# EAGLE design Temp (EAGLE 9.6.2)
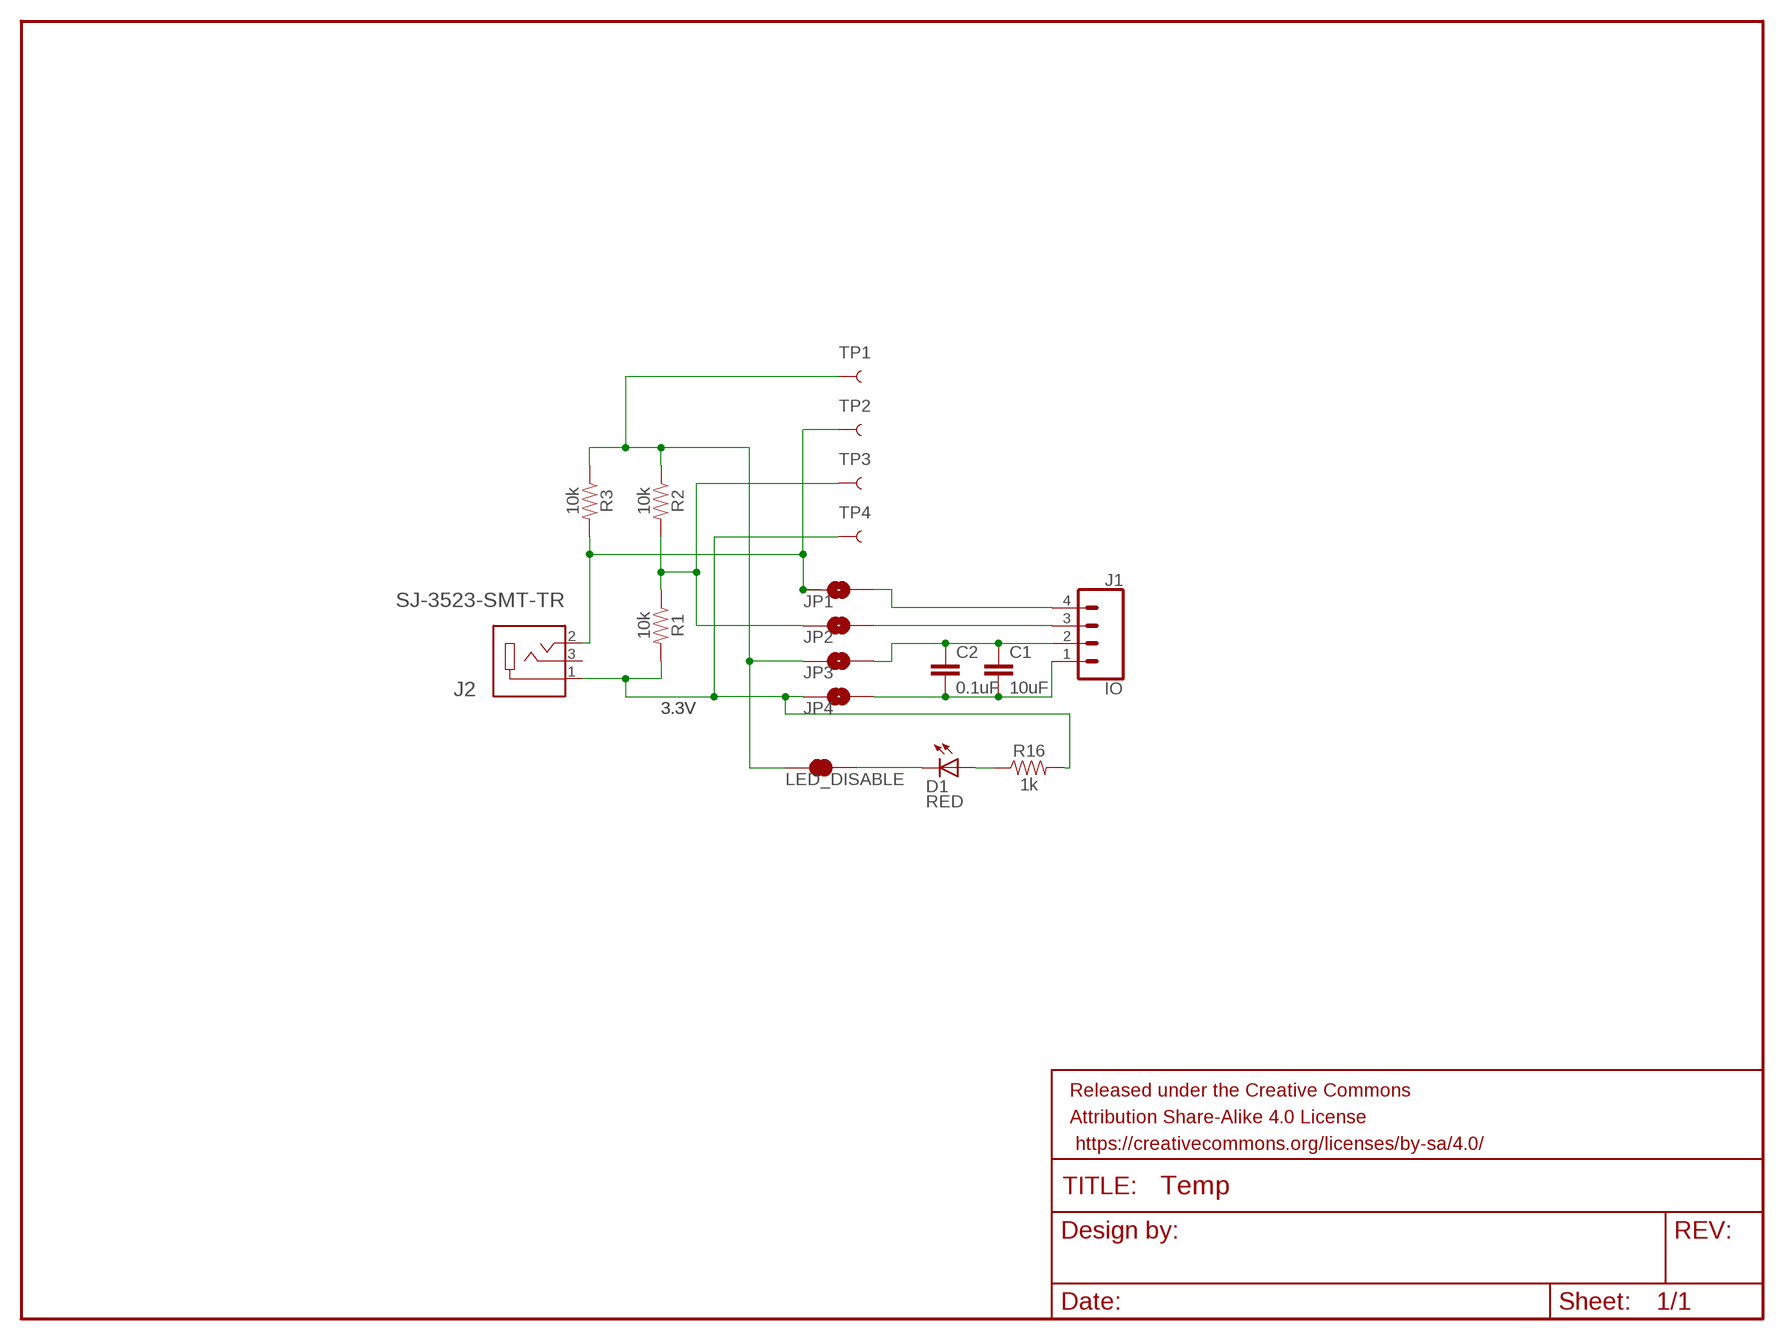
[diagram p0: schematic, sheet 1]

## Parts
C1  10uF  10UF-0603-6.3V-20%  [0603]
C2  0.1uF  0.1UF-0603-25V-(+80/-20%)  [0603]
D1  RED  LED-RED0603  [LED-0603]
FRAME1  FRAME-LETTERNO_PACKAGE  [DUMMY]
J1  IO  CONN_04  [1X04]
J2  SJ-3523-SMT-TR  [CUI_SJ-3523-SMT-TR]
JP1  JUMPER-SMT_2_NO_NO-SILK  [SMT-JUMPER_2_NO_NO-SILK]
JP2  JUMPER-SMT_2_NO_NO-SILK  [SMT-JUMPER_2_NO_NO-SILK]
JP3  JUMPER-SMT_2_NO_NO-SILK  [SMT-JUMPER_2_NO_NO-SILK]
JP4  JUMPER-SMT_2_NO_NO-SILK  [SMT-JUMPER_2_NO_NO-SILK]
LED_DISABLE  JUMPER-SMT_2_NC_TRACE_SILK  [SMT-JUMPER_2_NC_TRACE_SILK]
R1  10k  10KOHM-0603-1/10W-1%  [0603]
R2  10k  10KOHM-0603-1/10W-1%  [0603]
R3  10k  10KOHM-0603-1/10W-1%  [0603]
R16  1k  1KOHM-0603-1/10W-1%  [0603]
TP1  TEST-POINT3X5  [PAD.03X.05]
TP2  TEST-POINT3X5  [PAD.03X.05]
TP3  TEST-POINT3X5  [PAD.03X.05]
TP4  TEST-POINT3X5  [PAD.03X.05]

## Nets
3.3V: J2.1 JP4.1 R1.2 R16.2 TP4.P$1
N$1: JP3.1 LED_DISABLE.1 R2.1 R3.1 TP1.P$1
N$2: C1.2 C2.2 J1.1 JP4.2
N$3: JP2.1 R1.1 R2.2 TP3.P$1
N$4: C1.1 C2.1 J1.2 JP3.2
N$5: J1.3 JP2.2
N$6: J2.2 JP1.1 R3.2 TP2.P$1
N$7: J1.4 JP1.2
N$26: D1.A R16.1
N$28: D1.C LED_DISABLE.2
Unconnected: J2.3

## Library data of the parts
C1 = SparkFun-Capacitors:10UF: 10.0µF ceramic capacitors A capacitor is a passive two-terminal electrical component used to store electrical energy temporarily in an electric field.; PROD_ID: CAP-11015
C2 = SparkFun-Capacitors:0.1UF: 0.1µF ceramic capacitors A capacitor is a passive two-terminal electrical component used to store electrical energy temporarily in an electric field.; PROD_ID: CAP-00810
D1 = SparkFun-LED:LED-RED: Assorted Red LEDs LilyPad 1206- DIO-09912 1206- DIO-00809 0603- DIO-00819; PROD_ID: DIO-00819
FRAME1 = SparkFun-Aesthetics:FRAME-LETTER: Schematic Frame - Letter Standard 8.5x11 US Letter frame; DESIGNER: Nobody; VERSION: v01
J1 = SparkFun-Connectors:CONN_04: Multi connection point. Often used as Generic Header-pin footprint for 0.1 inch spaced/style header connections On any of the 0.1 inch spaced packages, you can populate with these: Break Away Headers - Straight <https://www.sparkfun.com/products/116> (PRT-00116) Break Away Male Headers - Right Angle <https://www.sparkfun.com/products/553> (PRT-00553) Female Headers <https://www.sparkfun.com/products/115> (PRT-00115) Break Away Headers - Machine Pin <https://www.sparkfun.com/products/117> (PRT-00117) Break Away Female Headers - Swiss Machine Pin <https://www.sparkfun.com/products/743> (PRT-00743) For SCREWTERMINALS and SPRING TERMINALS visit here: Screw Terimnals on SparkFun.com <https://www.sparkfun.com/search/results?term=Screw+Terminals> (5mm/3.5mm/2.54mm spacing) This device is also useful as a general connection point to wire up your design to another part of your project. Our various solder wires solder well into these plated through hole pads. Hook-Up Wire - Assortment (Stranded, 22 AWG) <https://www.sparkfun.com/products/11375> (PRT-11375) Hook-Up Wire - Assortment (Solid Core, 22 AWG) <https://www.sparkfun.com/products/11367> (PRT-11367) View the entire wire category on our website here <https://www.sparkfun.com/categories/141> Special notes: Molex polarized connector foot print use with SKU : PRT-08231 with associated crimp pins and housings. 1MM SMD Version SKU: PRT-10208; PROD_ID: CONN-09696
J2 = SJ-3523-SMT-TR:SJ-3523-SMT-TR: Audio Jack Connector 3.5 mm Low Profile Surface Mount Stereo Jack, 3 Pin Right-Angle Check availability <https://pricing.snapeda.com/parts/SJ-3523-SMT-TR/CUI%20Devices/view-part?ref=eda>; AVAILABILITY: In Stock; CUI_PURCHASE_URL: https://www.cuidevices.com/product/interconnect/connectors/audio-connectors/jacks/sj-352x-smt-series?utm_source=snapeda.com&utm_medium=referral&utm_campaign=snapedaBOM; DESCRIPTION: 3.5 mm, Stereo, Right Angle, Surface Mount (SMT), 3 Conductors, 0~1 Internal Switches, Audio Jack Connector; MF: CUI Devices; MP: SJ-3523-SMT-TR; PACKAGE: None; PRICE: None; PURCHASE-URL: https://pricing.snapeda.com/search/part/SJ-3523-SMT-TR/?ref=eda
JP1-JP4 = SparkFun-Jumpers:JUMPER-SMT_2_NO: Normally open jumper This jumper has two pads in close proximity to each other. Apply solder to close the connection. Round pads are easier to solder for beginners, but are a lot larger. SparkFun Product that uses the round pads: SparkFun EL Sequencer <https://www.sparkfun.com/products/12781>
LED_DISABLE = SparkFun-Jumpers:JUMPER-SMT_2_NC_TRACE: Normally closed trace jumper This jumper has a trace between two pads so it's normally closed (NC). Use a razor knife to open the connection. For best results follow the IPC guidelines for cutting traces: Cutout at least 0.063 mm (0.005 in). Remove all loose material to clean up the cut area. Seal the cut with an approved epoxy. Reapply solder to reclose the connection.
R1-R3 = SparkFun-Resistors:10KOHM: 10kΩ resistor A resistor is a passive two-terminal electrical component that implements electrical resistance as a circuit element. Resistors act to reduce current flow, and, at the same time, act to lower voltage levels within circuits. - Wikipedia; PROD_ID: RES-00824
R16 = SparkFun-Resistors:1KOHM: 1kΩ resistor A resistor is a passive two-terminal electrical component that implements electrical resistance as a circuit element. Resistors act to reduce current flow, and, at the same time, act to lower voltage levels within circuits. - Wikipedia; PROD_ID: RES-07856
TP1-TP4 = SparkFun-Connectors:TEST-POINT: SparkFun Test Points Bare copper test points for troubleshooting or In-Circuit-Testing. These are used by our Production team for verifying production board runs using pogo-pins on test beds. SparkFun Products: SparkFun LSM9DS1 Breakout <https://www.sparkfun.com/products/13284> SparkFun PSOC <https://www.sparkfun.com/products/13714> SparkFun Load Cell Amplifier <https://www.sparkfun.com/products/13879>

## Board
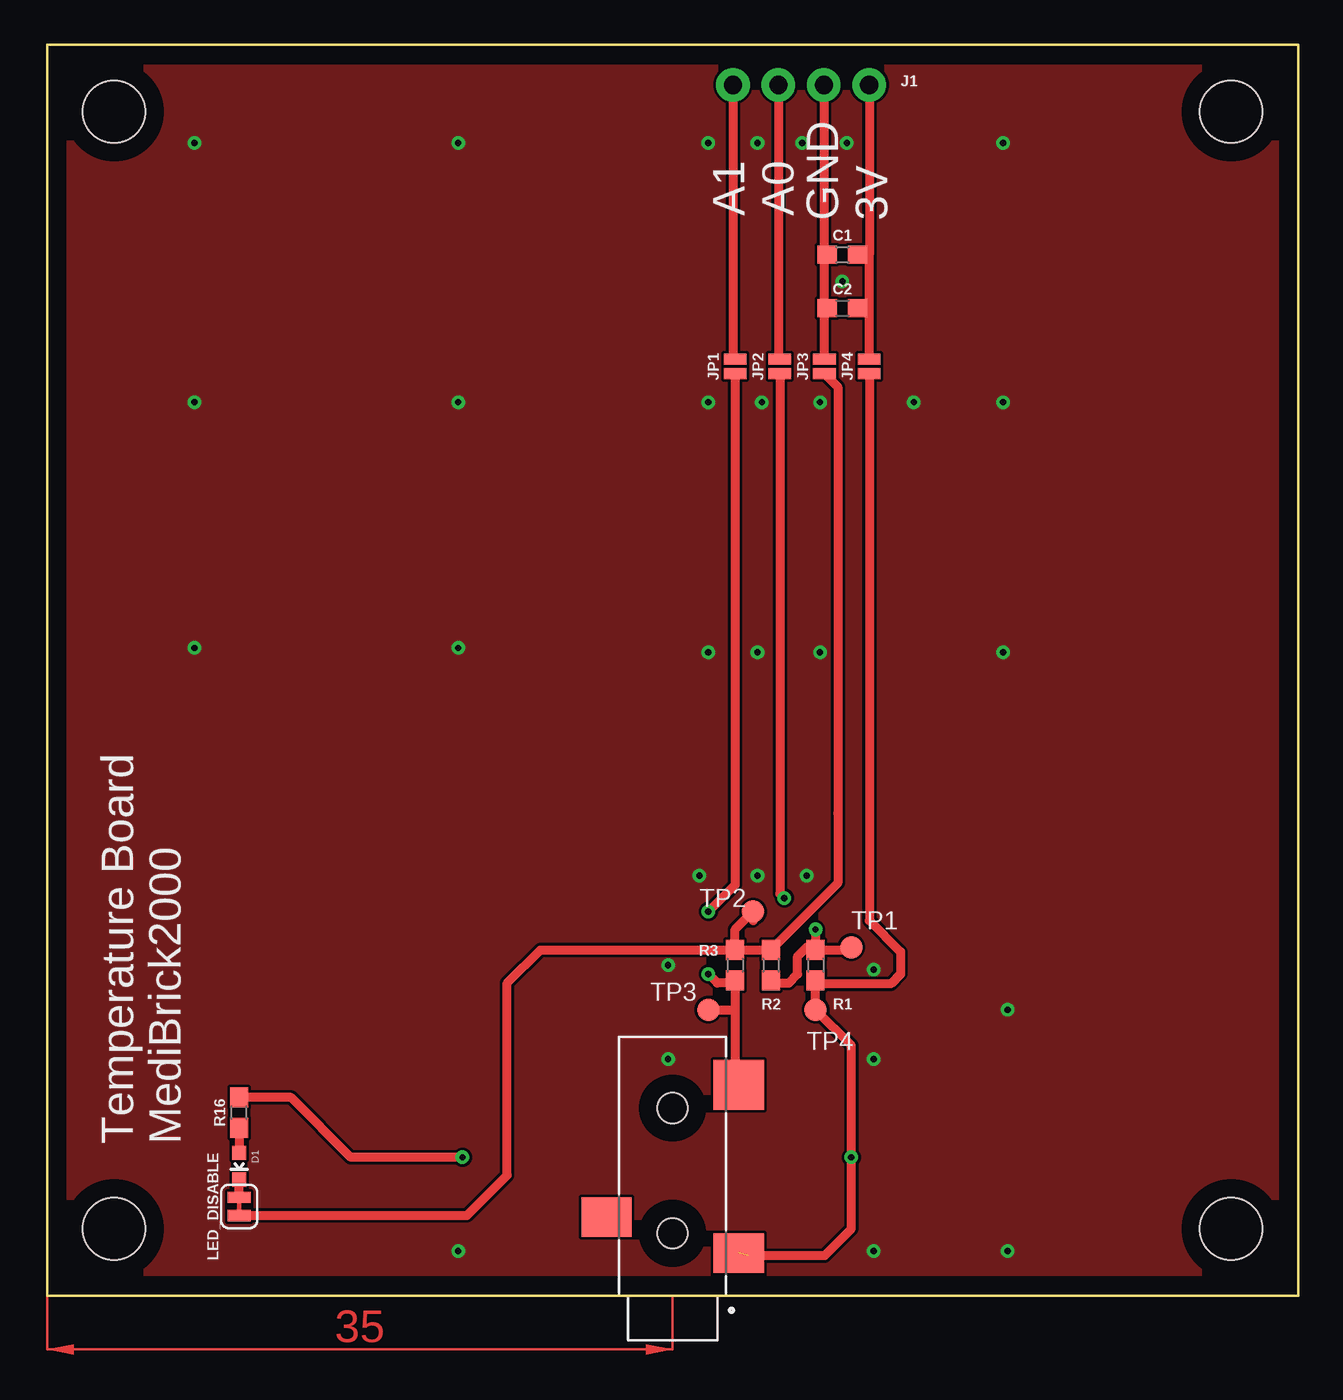
[diagram p1: board, top side]
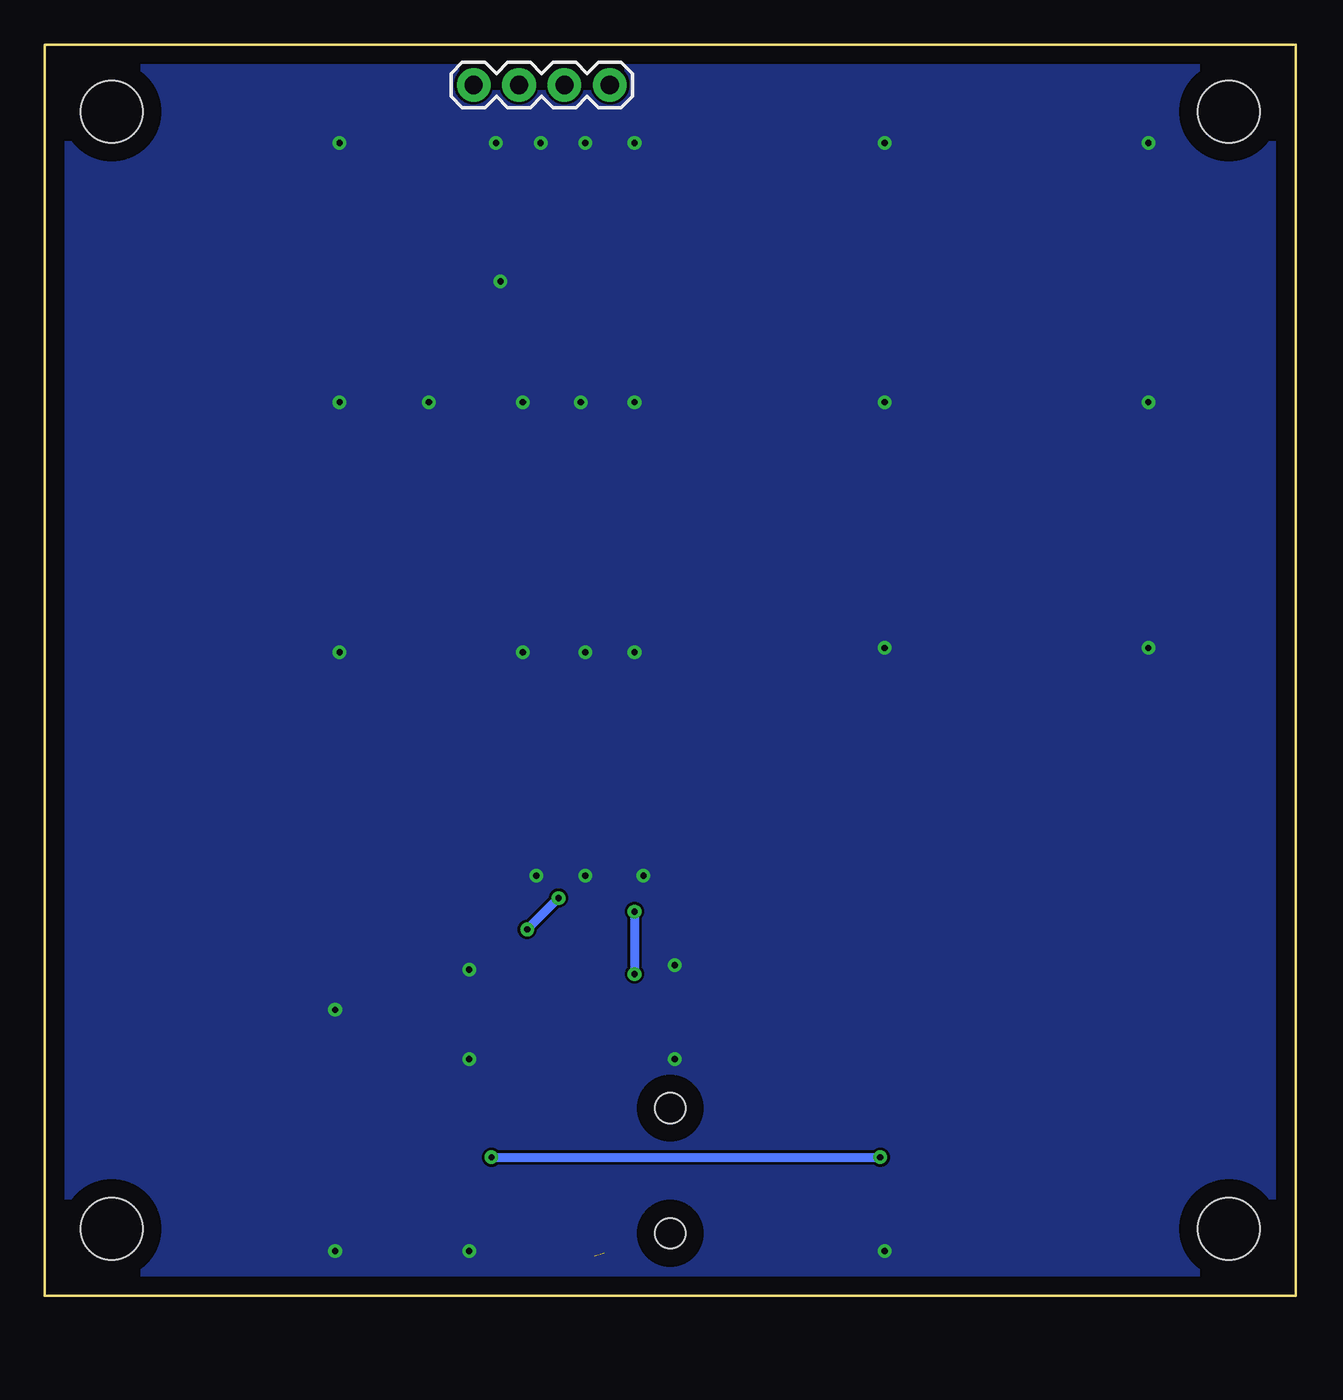
[diagram p2: board, bottom side, seen from below]

Size 70 x 70 mm. Coordinates in mm from the lower left corner, seen from the top.
Outline: 0,0 0,70 70,70 70,0 0,0
Copper layers (1*16): Top 0.035mm / dielectric 1.5mm / Bottom 0.035mm
Design rules "default": minimum track width 6mil, minimum drill 0.35mm, track to track 6mil, track to pad 6mil, pad to pad 6mil, via to via 6mil, smd to smd 6mil, copper to edge 40mil, drill to drill 6mil, minimum pad ring 10mil, minimum via ring 8mil, stop-mask expansion 4mil, vias tented up to drill 0mil, thermal gap 10mil
Holes 3.5 mm at 3.75,66.25 66.25,66.25 66.25,3.75 3.75,3.75

### Footprints (pad centres in the part's own frame; a part is rotated, then mirrored left to right if it is on the bottom)
0603 = smd 1.1 x 1: 1 -0.85,0; 2 0.85,0
LED-0603 = smd 0.8 x 0.8: A 0,-0.75; C 0,0.75
1X04 = drill 1.016 pad 1.88: 1 0,0; 2 2.54,0; 3 5.08,0; 4 7.62,0
CUI_SJ-3523-SMT-TR = smd 2.2 x 2.8: 1 -1.1,-3.7; 3 0.9,3.7 | smd 2.8 x 2.8: 2 8.3,-3.7 | hole 1.7: 0,0; 7,0
SMT-JUMPER_2_NO_NO-SILK = smd 0.635 x 1.27: 1 -0.406,0; 2 0.406,0
SMT-JUMPER_2_NC_TRACE_SILK = smd 0.635 x 1.27: 1 -0.508,0; 2 0.508,0
PAD.03X.05 = smd 1.27 x 1.27: P$1 0,0

### Placement (x,y rotation side)
C1  44.5,58.25 0 top
C2  44.5,55.25 0 top
D1  10.75,7.25 180 top
FRAME1  -0.25,-5.25 0 top  (outside the outline)
J1  46,67.75 0 bottom
J2  35,3.5 90 top
JP1  38.5,52 90 top
JP2  41,52 90 top
JP3  43.5,52 90 top
JP4  46,52 90 top
LED_DISABLE  10.75,5 90 top
R1  43,18.5 270 top
R2  40.5,18.5 270 top
R3  38.5,18.5 270 top
R16  10.75,10.25 90 top
TP1  39.5,21.5 0 top
TP2  37,16 0 top
TP3  45,19.5 0 top
TP4  43,16 0 top

### Tracks (layer width: path | path; a pad name or v marks a point on that pad's centre or on a via)
3.3V  (via drill 0.35)  (1 unrouted)
  Top 0.508: JP4.1 46,21 47.75,19.25 47.75,18 47.22,17.46 43.19,17.46 | 43.19,17.46 R1.2 | 39.25,2.25 43.5,2.25 45,3.75 v45,7.75 45,14 TP4.P$1 43,17.28 43.19,17.46 | v23.25,7.75 17,7.75 13.65,11.1 R16.2
  Bottom 0.508: v45,7.75 v23.25,7.75
GND  (via drill 0.35)
  other vias: 43.25,50 40,50 37,50 48.5,50 8.25,36.25 23,36.25 23,2.5 53.5,36 53.5,50 23,50 8.25,50 53.5,64.5 23,64.5 8.25,64.5 43.25,36 53.75,16 53.75,2.5 44.75,64.5 37,64.5 39.75,64.5 42.25,64.5 39.75,36 37,36 39.75,23.5 42.5,23.5 36.5,23.5 34.75,18.5 46.25,18.25 34.75,13.25 46.25,13.25 46.25,2.5 44.5,56.75
  pour Bottom: 0,70 0,0 70,0 70,70
  pour Top: 0,70 0,0 70,0 70,70
N$1
  Top 0.508: 39.5,21 TP1.P$1 38.5,20.5 R3.1 | JP3.1 44.25,50.84 44.25,27 44.25,23.1 R2.1 R3.1 | LED_DISABLE.1 23.49,4.49 25.75,6.75 25.75,17.5 27.6,19.35 R3.1
N$2
  Top 0.508: JP4.2 46,55.25 | 46,55.25 C2.2 | 46,55.25 46,58.25 | 46,58.25 45.88,58.38 | 45.88,58.38 45.75,58.5 45.5,58.5 | J1.1 46,58.25 | C1.2 45.48,58.38 45.88,58.38
N$3  (via drill 0.35)
  Top 0.508: R2.2 40.65,17.5 41.5,17.5 42,18 42,19 42.5,19.5 43,19.5 R1.1 | R1.1 44.85,19.35 TP3.P$1 | v41.25,22.25 41,22.5 JP2.1 | v43,20.5 R1.1
  Bottom 0.508: v43,20.5 v41.25,22.25
N$4
  Top 0.508: J1.2 43.46,58.06 | 43.46,52.61 43.5,52.57 | C1.1 43.46,58.06 | 43.46,58.06 43.46,55.06 | C2.1 43.46,55.06 | 43.46,55.06 43.46,52.61 | JP3.2 43.46,52.45 43.46,52.61
N$5
  Top 0.508: J1.3 40.92,52.65 | 40.92,52.65 41,52.57 | JP2.2 40.92,52.49 40.92,52.65
N$6  (via drill 0.35)
  Top 0.152: J2.2 38.5,12
  Top 0.508: 38.5,16 R3.2 38.35,17.5 37.5,17.5 v37,18 | 38.5,16 38.5,12 | TP2.P$1 38.5,16 | JP1.1 38.5,23 v37,21.5
  Bottom 0.508: v37,21.5 v37,18
N$7
  Top 0.508: J1.4 38.38,52.69 | 38.38,52.69 38.5,52.57 | JP1.2 38.38,52.53 38.38,52.69
N$26
  Top 0.508: R16.1 D1.A
N$28
  Top 0.508: LED_DISABLE.2 D1.C
(copper drawn outside any net)
  shapes: Top area x1

### Text on the board
tNames: GND | A1 | A0 | 3V | TP2 | TP1 | TP3 | TP4 | Temperature Board / MediBrick2000